# EAGLE design SensorHub_R2 (EAGLE 6.6.0)
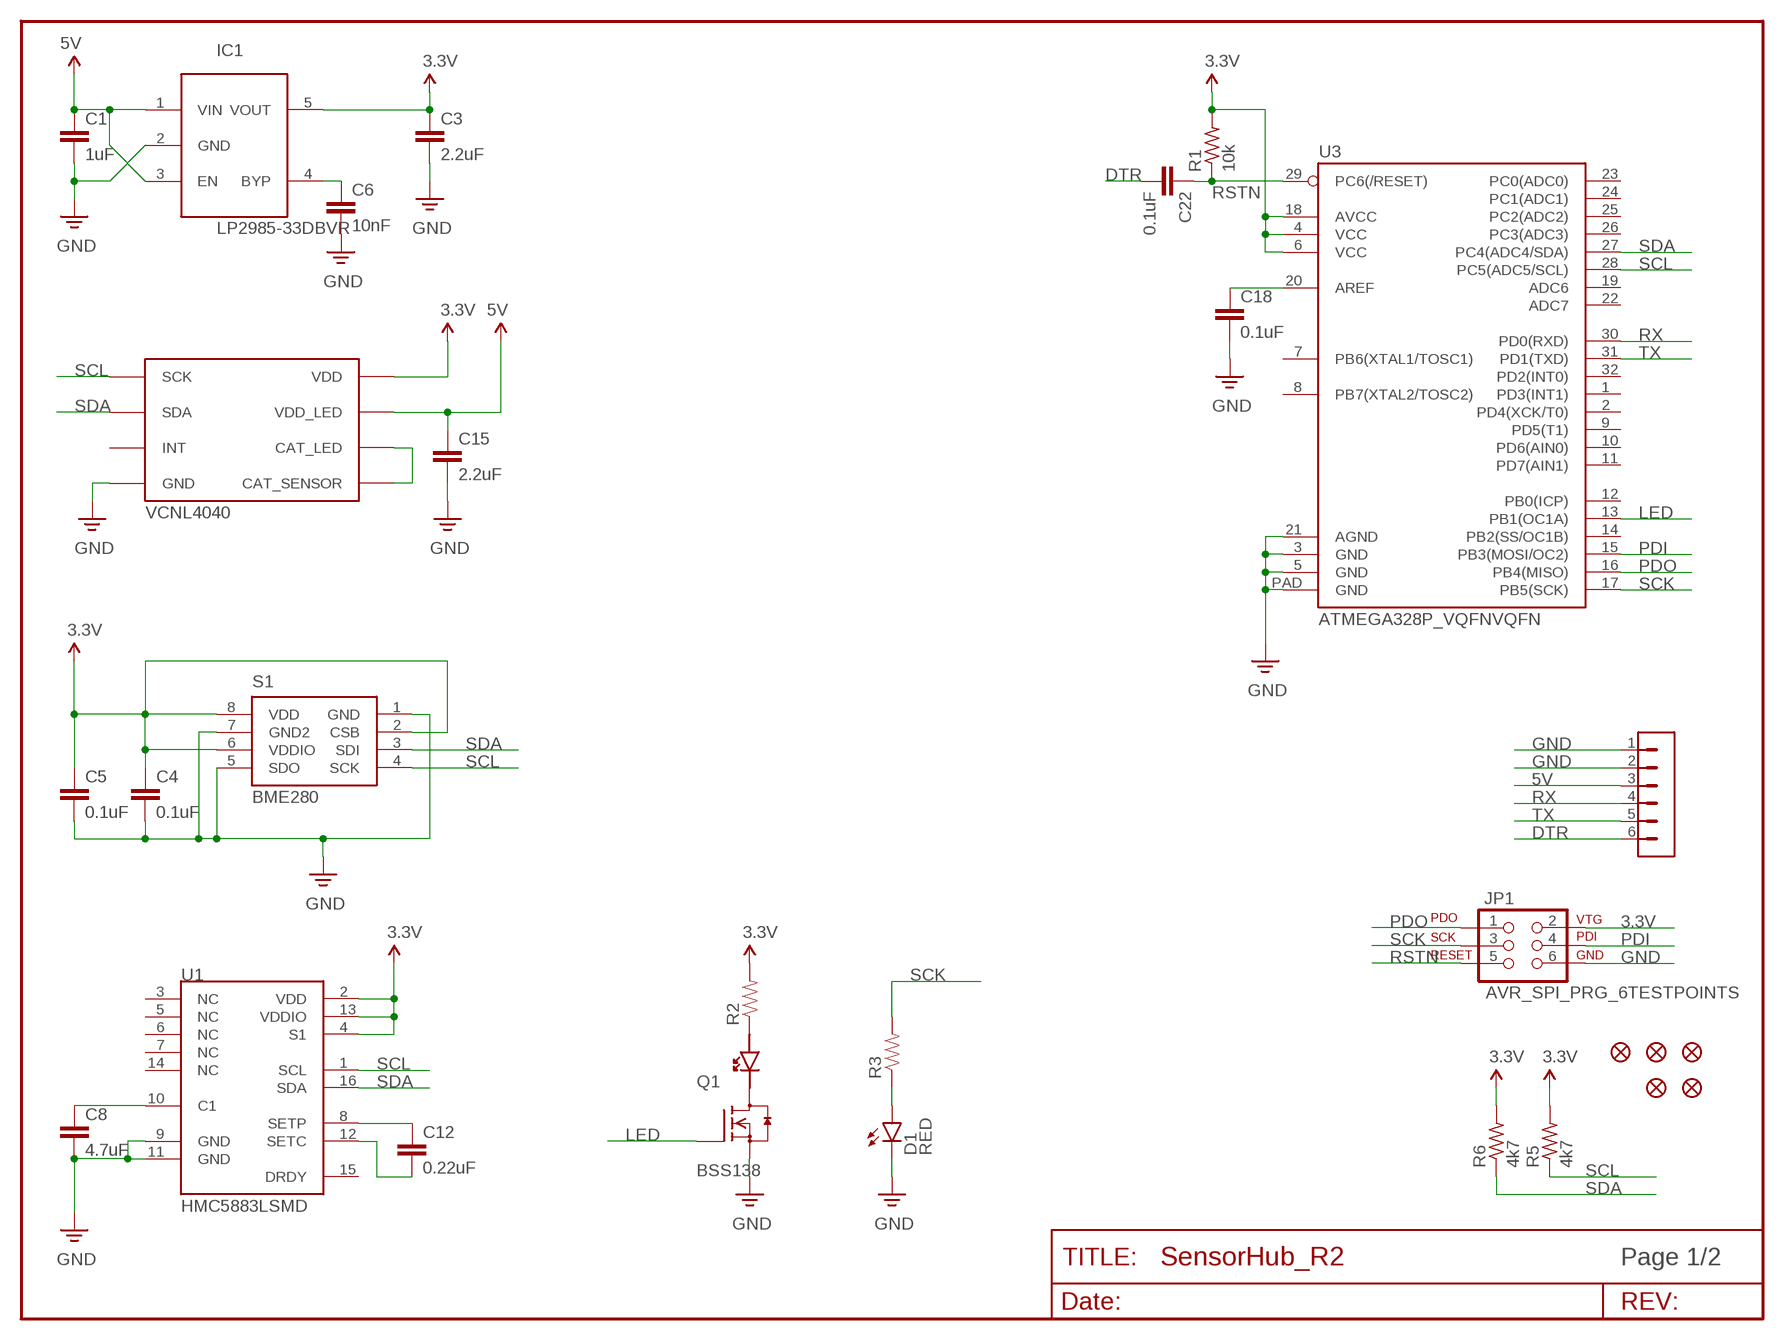
[diagram p0: schematic, sheet 1]

## Parts
C1  1uF  CAP0603-CAP  [0603-CAP]
C3  2.2uF  CAP0603-CAP  [0603-CAP]
C4  0.1uF  CAP0603-CAP  [0603-CAP]
C5  0.1uF  CAP0603-CAP  [0603-CAP]
C6  10nF  CAP0603-CAP  [0603-CAP]
C8  4.7uF  CAP0603-CAP  [0603-CAP]
C12  0.22uF  CAP0603-CAP  [0603-CAP]
C15  2.2uF  CAP0603-CAP  [0603-CAP]
C18  0.1uF  CAP0603-CAP  [0603-CAP]
C22  0.1uF  CAP0603-CAP  [0603-CAP]
D1  RED  LED-RED0603  [LED-0603]
FID1  FIDUCIALUFIDUCIAL  [MICRO-FIDUCIAL]
FID2  FIDUCIALUFIDUCIAL  [MICRO-FIDUCIAL]
FID3  FIDUCIALUFIDUCIAL  [MICRO-FIDUCIAL]
FID4  FIDUCIALUFIDUCIAL  [MICRO-FIDUCIAL]
FID5  FIDUCIALUFIDUCIAL  [MICRO-FIDUCIAL]
IC1  LP2985-33DBVR  LP298XS  [SOT23-5L]
JP1  AVR_SPI_PRG_6TESTPOINTS  [2X3_TEST_POINTS]
Q1  BSS138  [SOT23]
R1  10k  R-US_R0603  [R0603]
R2  RESISTOR0603  [0603-RES]
R3  RESISTOR0603  [0603-RES]
R5  4k7  R-US_R0603  [R0603]
R6  4k7  R-US_R0603  [R0603]
S1  BME280  [BME280]
U1  HMC5883LSMD  [16LPCC]
U3  ATMEGA328P_VQFNVQFN  ATMEGA328P_MLFMLF32  [MLF32-PAD]
U$1  M06-LONG  [M06-LONG]
U$3  VCNL4040  [VCNL4040]
U$4  PLCC_LED  [LED-PLCC]

## Nets
3.3V: C3.1 C4.1 C5.1 IC1.5(VOUT) JP1.2 R1.2 R2.2 R5.2 R6.2 S1.2(CSB) S1.6(VDDIO) S1.8(VDD) U1.2(VDD) U1.4(S1) U1.13(VDDIO) U3.4(VCC) U3.6(VCC) U3.18(AVCC) U$3.3(VDD)
5V: C1.1 C15.1 IC1.1(VIN) IC1.3(EN) U$1.3 U$3.4(VDD_LED)
DTR: C22.2 U$1.6
GND: C1.2 C3.2 C4.2 C5.2 C6.2 C8.2 C15.2 C18.2 D1.C IC1.2(GND) JP1.6 Q1.2(S) S1.1(GND) S1.5(SDO) S1.7(GND2) U1.9(GND) U1.11(GND) U3.3(GND) U3.5(GND) U3.21(AGND) U3.PAD(GND) U$1.1 U$1.2 U$3.1(GND)
LED: Q1.1(G) U3.13(PB1(OC1A))
N$2: Q1.3(D) U$4.CATHODE
N$3: R2.1 U$4.ANODE
N$4: D1.A R3.1
N$6: C6.1 IC1.4(BYP)
N$9: U$3.2(CAT_SENSOR) U$3.5(CAT_LED)
N$12: C18.1 U3.20(AREF)
N$14: C8.1 U1.10(C1)
N$15: C12.1 U1.8(SETP)
N$16: C12.2 U1.12(SETC)
PDI: JP1.4 U3.15(PB3(MOSI/OC2))
PDO: JP1.1 U3.16(PB4(MISO))
RSTN: C22.1 JP1.5 R1.1 U3.29(PC6(/RESET))
RX: U3.30(PD0(RXD)) U$1.4
SCK: JP1.3 R3.2 U3.17(PB5(SCK))
SCL: R5.1 S1.4(SCK) U1.1(SCL) U3.28(PC5(ADC5/SCL)) U$3.8(SCK)
SDA: R6.1 S1.3(SDI) U1.16(SDA) U3.27(PC4(ADC4/SDA)) U$3.7(SDA)
TX: U3.31(PD1(TXD)) U$1.5
Unconnected: U1.3(NC) U1.5(NC) U1.6(NC) U1.7(NC) U1.14(NC) U1.15(DRDY) U3.1(PD3(INT1)) U3.2(PD4(XCK/T0)) U3.7(PB6(XTAL1/TOSC1)) U3.8(PB7(XTAL2/TOSC2)) U3.9(PD5(T1)) U3.10(PD6(AIN0)) U3.11(PD7(AIN1)) U3.12(PB0(ICP)) U3.14(PB2(SS/OC1B)) U3.19(ADC6) U3.22(ADC7) U3.23(PC0(ADC0)) U3.24(PC1(ADC1)) U3.25(PC2(ADC2)) U3.26(PC3(ADC3)) U3.32(PD2(INT0)) U$3.6(INT)

## Notes on the sheet
- Page 1/2

## Library data of the parts
C1 C3-C6 C8 C12 C15 C18 C22 = SparkFun-Capacitors:CAP: Capacitor Standard 0603 ceramic capacitor, and 0.1" leaded capacitor.
D1 = SparkFun-LED:LED-RED: Assorted Red LEDs LilyPad 1206- DIO-09912 1206- DIO-00809 0603- DIO-00819 "SMART" means more efficient and expensive; PROD_ID: DIO-00819
FID1-FID5 = SparkFun-Aesthetics:FIDUCIAL: Fiducial Alignment Points Various fiducial points for machine vision alignment.
IC1 = adafruit:LP298X
JP1 = SparkFun-Connectors:AVR_SPI_PRG_6: AVR ISP 6 Pin This is the reduced ISP connector for AVR programming. Common on Arduino. This footprint will take up less PCB space and can be used with a 10-pin to 6-pin adapter such as SKU: BOB-08508 **Special note about "TEST_POINT" package. The stop mask is on the top side, so if you want your programming test points to be on the bottom of your board, make sure to place this package on the bottom side of the board. This also ensure that the orientation to program from the bottom side will be correct.
Q1 = m-pad-2.1:BSS138: Fairchild Semiconductors BSS138 N-Channel Logic Level Enhancement Mode Field Effect Transistor General Description: These N-Channel enhancement mode field effect transistors are produced using Fairchild's proprietary, high cell density, DMOS technology. These products have been designed to minimize on-state resistance while provide rugged, reliable, and fast switching performance.These products are particularly suited for low voltage, low current applications such as small servo motor control, power MOSFET gate drivers, and other switching applications. Features: 0.22 A, 50 V. RDS(ON) = 3.5Ohm @ VGS = 10 V RDS(ON) = 6.0Ohm @ VGS = 4.5 V High density cell design for extremely low RDS(ON) Rugged and Reliable Compact industry standard SOT-23 surface mount package Please send any comments to: messi@users.sourceforge.net
R1 R5 R6 = adafruit:R-US_: RESISTOR, American symbol
R2 R3 = SparkFun-Resistors:RESISTOR: Resistor Basic schematic elements and footprints for 0603, 1206, and PTH resistors.
S1 = L1:BME280
U1 = SparkFun-Sensors:HMC5883L: 3 Axis Digital Compass IC; PROD_ID: IC-10284
U3 = SparkFun-DigitalIC:ATMEGA328P_MLF: 32-Pin Atmega328 part Commonly used on Arduino compatible boards Available in QFP and QFN packages TQFP is IC-09069 QFN is non-stock
U$1 = pinhead-half:M06-LONG
U$3 = L1:VCNL4040
U$4 = L1:PLCC_LED

## Net classes
1 Tline: width 0.003 mm, drill 0.33 mm
2 120v Mains 5A: clearance 1.27 mm

## Board
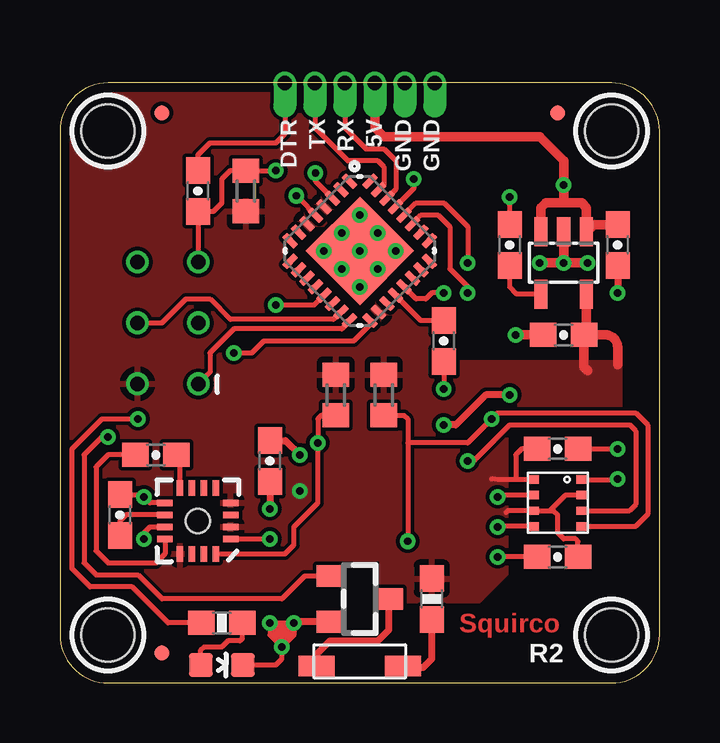
[diagram p1: board, top side]
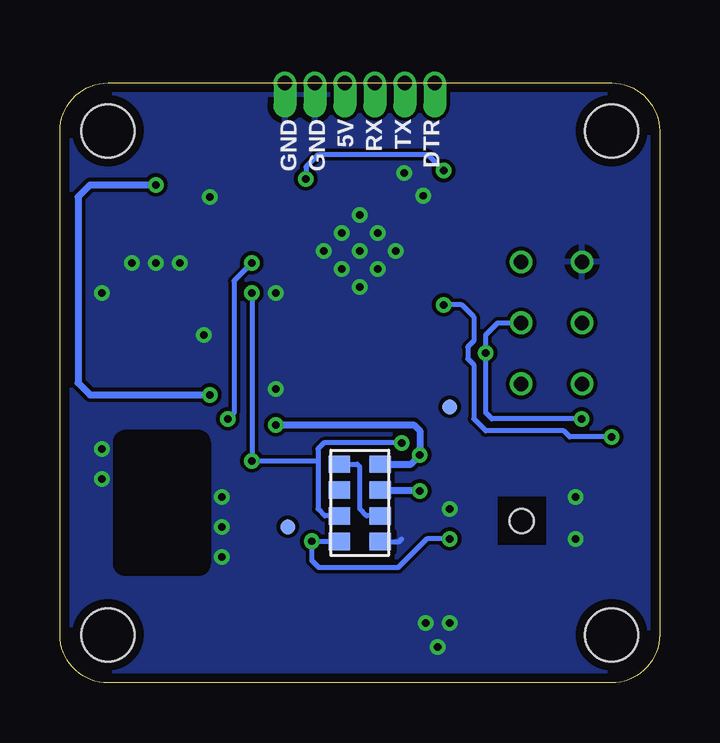
[diagram p2: board, bottom side, seen from below]

Size 25 x 25 mm. Coordinates in mm from the lower left corner, seen from the top.
Outline: 0,23 0,2 arc90 2,0 23,0 arc90 25,2 25,23 arc90 23,25 2,25 arc90 0,23
Copper layers (1*16): Top 0.0356mm / dielectric 1.5011mm / Bottom 0.0356mm
Design rules "LaenPCBOrder": minimum track width 6mil, minimum drill 0.3mm, track to track 6mil, track to pad 6mil, pad to pad 6mil, via to via 6mil, smd to smd 6mil, copper to edge 15mil, drill to drill 6mil, minimum pad ring 7mil, minimum via ring 7mil, stop-mask expansion 3mil, vias tented up to drill 15mil, thermal gap 10mil
Holes 2.2 mm at 23,2 2,2 2,23 23,23
Holes 1 mm at 5.75,6.75

### Footprints (pad centres in the part's own frame; a part is rotated, then mirrored left to right if it is on the bottom)
0603-CAP = smd 1.1 x 1: 1 -0.85,0; 2 0.85,0
LED-0603 = smd 1 x 1: A 0,-0.877; C 0,0.877
MICRO-FIDUCIAL = smd 0.635 x 0.635: 1 0,0
SOT23-5L = smd 0.55 x 1.2: 1 -0.95,-1.3; 2 0,-1.3; 3 0.95,-1.3; 4 0.95,1.3; 5 -0.95,1.3
2X3_TEST_POINTS = drill 0.6: 1 -2.54,-1.27; 2 -2.54,1.27; 3 0,-1.27; 4 0,1.27; 5 2.54,-1.27; 6 2.54,1.27
SOT23 = smd 0.9 x 1.2: 1 -0.95,-1.2; 2 0.95,-1.2; 3 0,1.2
R0603 = smd 1 x 1.1: 1 -0.85,0; 2 0.85,0
0603-RES = smd 1.1 x 1: 1 -0.85,0; 2 0.85,0
BME280 = smd 0.5 x 0.35: 1 1.025,0.975; 2 1.025,0.325; 3 1.025,-0.325; 4 1.025,-0.975; 5 -1.025,-0.975; 6 -1.025,-0.325; 7 -1.025,0.325; 8 -1.025,0.975
16LPCC = smd 0.65 x 0.28: 1 -1.37,0.75; 2 -1.37,0.25; 3 -1.37,-0.25; 4 -1.37,-0.75; 9 1.37,-0.75; 10 1.37,-0.25; 11 1.37,0.25; 12 1.37,0.75 | smd 0.28 x 0.65: 5 -0.75,-1.37; 6 -0.25,-1.37; 7 0.25,-1.37; 8 0.75,-1.37; 13 0.75,1.37; 14 0.25,1.37; 15 -0.25,1.37; 16 -0.75,1.37
MLF32-PAD = smd 0.7 x 0.3: 1 -2.35,1.75; 2 -2.35,1.25; 3 -2.35,0.75; 4 -2.35,0.25; 5 -2.35,-0.25; 6 -2.35,-0.75; 7 -2.35,-1.25; 8 -2.35,-1.75; 17 2.35,-1.75; 18 2.35,-1.25; 19 2.35,-0.75; 20 2.35,-0.25; 21 2.35,0.25; 22 2.35,0.75; 23 2.35,1.25; 24 2.35,1.75 | smd 0.3 x 0.7: 9 -1.75,-2.35; 10 -1.25,-2.35; 11 -0.75,-2.35; 12 -0.25,-2.35; 13 0.25,-2.35; 14 0.75,-2.35; 15 1.25,-2.35; 16 1.75,-2.35; 25 1.75,2.35; 26 1.25,2.35; 27 0.75,2.35; 28 0.25,2.35; 29 -0.25,2.35; 30 -0.75,2.35; 31 -1.25,2.35; 32 -1.75,2.35 | smd 3.2 x 3.2: PAD 0,0
M06-LONG = drill 0.6 offset: 1 0,-3.125; 2 0,-1.875; 3 0,-0.625; 4 0,0.625; 5 0,1.875; 6 0,3.125
VCNL4040 = smd 0.9 x 0.725: 1 0.85,-1.613; 2 0.85,-0.537; 3 0.85,0.537; 4 0.85,1.613; 5 -0.85,1.613; 6 -0.85,0.537; 7 -0.85,-0.537; 8 -0.85,-1.613
LED-PLCC = smd 1.5 x 0.85: ANODE -1.8,0; CATHODE 1.8,0

### Placement (x,y rotation side)
C1  23.25,18.25 270 top
C3  21,14.5 180 top
C4  20.75,9.75 0 top
C5  20.75,5.25 180 top
C6  18.75,18.25 90 top
C8  2.5,7 90 top
C12  4,9.5 180 top
C15  8.75,9.25 270 top
C18  16,14.25 270 top
C22  5.75,20.5 90 top
D1  6.75,0.75 270 top
FID1  20.75,23.75 0 top
FID2  15.5,6.5 0 bottom
FID3  4.25,1.25 0 top
FID4  4.25,23.75 0 top
FID5  8.75,11.5 0 bottom
IC1  21,17.5 180 top
JP1  4.5,15 90 top
Q1  12.5,3.5 270 top
R1  7.75,20.5 270 top
R2  15.5,3.5 90 top
R3  6.75,2.5 180 top
R5  13.5,12 90 top
R6  11.5,12 90 top
S1  20.75,7.5 0 top
U1  5.75,6.75 180 top
U3  12.5,18 315 top
U$1  12.5,25 90 top
U$3  12.5,7.5 0 bottom
U$4  12.5,0.7 180 top

### Tracks (layer width: path | path; a pad name or v marks a point on that pad's centre or on a via)
3.3V  (via drill 0.3)
  Top 0.2: S1.8 19,8.47 | 19,8.47 18.27,8.47 18,8.5 | C4.1 19.25,9.75 19,9.5 19,8.47 | 20.43,7.17 S1.6 18.68,7.17 18.6,7.1 | 20.43,7.17 21.07,7.83 S1.2 | C5.1 21.6,5.9 21.5,6 21,6 20.75,6.25 20.75,7 20.57,7.17 20.43,7.17
  Top 0.4: IC1.5 21.95,14.6 C3.1 21.85,13.15 22,13 | 22,14.5 22.75,14.5 arc-90 23.25,14 23.25,13.25
  Bottom 0.3: U$3.3 10.04,8.04 v10,8
  pour Top: -0.5,25 26.25,25 26,-0.75 -0.75,-0.75
5V  (via drill 0.3)
  Top 0.3: v18.75,12 17.75,12 16.5,10.75 v16,10.75 | C15.1 9.4,10.1 v10,9.5
  Top 0.4: IC1.3 20.05,19.8 20.25,20 21,20 | C1.1 22.25,19.1 IC1.1 21.95,19.8 21.75,20 21,20 | 21,20 v21,20.75 21,21.75 20,22.75 13.5,22.75 13.12,23.12 U$1.3
  Bottom 0.3: U$3.4 10.36,9.11 v10,9.5 10,10.5 10.25,10.75 v16,10.75 | v18.75,12 23.75,12 24.25,12.5 24.25,20.25 23.75,20.75 v21,20.75
DTR
  Top 0.2: C22.2 5.75,22 6.25,22.5 9,22.5 9.38,22.88 U$1.6
GND  (via drill 0.3)
  Top 0.2: 10.35,19.8 U3.5 10,20.15 v9.85,20.3 | 11.05,20.5 11.36,20.19 U3.3 10.65,20.91 v10.65,21.25 | C6.2 v18.75,20.25 | U1.9 3.75,7.5 v3.5,7.75 3.4,7.85 C8.2 | v3.5,6 3.5,6.25 3.75,6.5 U1.11 | S1.7 18.32,7.83 v18.25,7.75 | S1.5 18.27,6.53 v18.25,6.5 | C4.2 v23.25,9.75 | S1.1 22.98,8.47 v23.25,8.5 | C5.2 v18.25,5.25 | U3.21 14.85,16 15.25,16 15.5,16.25 v16,16.25 | C18.2 v16,12.25 | D1.C 9,0.75 9.25,1 v9.25,1.5 | 9.25,2 v8.75,2.5 | v8.75,2.5 9,2.5 | 9,2.5 v9.75,2.5 | v9.75,2.5 9.75,2.25 | 9.75,2.25 9.75,2 v9.25,1.5 | v8.75,2.5 8.75,2.25 | 8.75,2.25 8.75,2 v9.25,1.5 | v9.25,1.5 9.25,1.75 | 9.25,1.75 9.25,2 | 9.25,2 v9.75,2.5 | v9.75,2.5 9.5,2.5 9.25,2.25 9,2.5 | 8.75,2.25 9.25,1.75 | 9.25,1.75 9.75,2.25
  Top 0.3: C15.2 v8.75,7.25 | Q1.2 9.8,2.55 v9.75,2.5 | C1.2 v23.25,16.25
  Top 0.4: v21,17.5 IC1.2 | v22,17.5 v20,17.5 | v19,14.5 C3.2
  Bottom 0.2: U$3.1 10.86,5.89 10.75,6
  other vias: 12.5,18 13.25,18.75 12.5,16.5 11,18 14,18 11.75,18.75 12.5,19.5 13.25,17.25 11.75,17.25
  pour Bottom: -1.5,25 27,25 27,-2 -1.5,-2
LED  (via drill 0.3)
  Top 0.2: v2,10.25 1.75,10.25 1,9.5 1,5 1.5,4.5 3.25,4.5 4.25,3.5 9.25,3.5 10.2,4.45 Q1.1 | v9,15.75 10.6,15.75 U3.13
  Bottom 0.2: v9,15.75 8.25,15.75 7.75,15.25 7.75,14.25 8,14 8,13.5 7.75,13.25 7.75,11 7.25,10.5 4,10.5 3.75,10.25 v2,10.25
N$1
  cutout Top: 4.85,7.65 6.65,7.65 6.65,5.85 4.85,5.85
  cutout Bottom: 4.75,7.75 6.75,7.75 6.75,5.75 4.75,5.75
N$2
  Top 0.3: U$4.CATHODE 10.7,1.2 11.25,1.75 13.25,1.75 13.7,2.2 Q1.3
N$3
  Top 0.3: U$4.ANODE 14.5,0.65 15.15,0.65 15.5,1 R2.1
N$4
  Top 0.2: R3.1 7.6,1.85 7.5,1.75 7,1.75 6.75,1.5 6,1.5 5.87,1.37 D1.A
N$5
  cutout Top: 15.5,25.25 15.5,13.5 23.5,13.5 23.5,11.25 25.25,11.25 25.25,25.25
N$6
  Top 0.2: IC1.4 19.05,16.2 18.75,16.5 C6.1
N$7
  cutout Top: 19.45,16.65 19.45,18.35 22.5,18.35 22.5,16.65
N$8
  cutout Bottom: 11.1,9.9 13.9,9.9 13.9,5.1 11.1,5.1
N$9
  Bottom 0.2: U$3.5 12.61,9.11 12.5,9 12.5,7.25 12.21,6.96 U$3.2
N$10
  cutout Top: 22.25,4.5 18.75,4.5 18.75,10 arc-90 19.25,10.5 22.25,10.5 arc-90 22.75,10 22.75,5 arc-90
N$11
  cutout Top: 0.25,0.25 0.25,3.25 11.75,3.25 11.75,5 13.25,5 13.25,3.25 17.5,3.25 18.75,4.5 24.75,4.5 24.75,0.25
N$12
  Top 0.2: C18.1 15.05,15.1 U3.20
N$13
  cutout Bottom: 22.25,4.5 19.25,4.5 arc-90 18.75,5 18.75,10 arc-90 19.25,10.5 22.25,10.5 arc-90 22.75,10 22.75,5 arc-90
N$14
  Top 0.2: U1.10 2.75,7 2.5,6.75 C8.1
N$15
  Top 0.2: U1.8 5,9.1 C12.1
N$16
  Top 0.2: C12.2 2,9.5 1.5,9 1.5,5.5 2,5 4,5 4.38,5.38 U1.12
N$17
  cutout Top: 5.25,20.75 8.25,20.75 8.25,20.25 5.25,20.25
PDI
  Top 0.2: U3.15 11.7,15.45 11.4,15.15 7.1,15.15 6.25,16 5.25,16 4.25,15 JP1.4
PDO
  Top 0.2: U3.16 12.08,15.08 11.75,14.75 7.25,14.75 6.25,13.75 6.25,12.94 JP1.1
RSTN  (via drill 0.3)
  Top 0.2: v9,21.35 R1.1 7.1,21.35 6.75,21 6.75,20 6.4,19.65 C22.1 5.75,17.56 JP1.5 | v14.75,21 14.75,20.6 U3.29 13.98,19.89
  Bottom 0.2: v14.75,21 14.75,21.5 14.25,22 9.65,22 v9,21.35
RX
  Top 0.2: U3.30 14,20.56 14,21.75 13.5,22.25 12.75,22.25 11.88,23.12 U$1.4
SCK  (via drill 0.3)
  Top 0.2: U3.17 12.92,14.92 12.25,14.25 8.5,14.25 8,13.75 v7.25,13.75 | R3.2 4.5,2.5 3,4 1.25,4 0.5,4.75 0.5,9.75 1.75,11 v3.25,11
  Bottom 0.2: v3.25,11 7,11 7.25,11.25 v7.25,13.75 7.25,14.5 6.75,15 JP1.3
SCL  (via drill 0.3)
  Top 0.2: U1.1 v8.75,6 | S1.4 24,6.53 24.5,7.03 24.5,10.75 24,11.25 18.25,11.25 v18,11 17,10 14.5,10 | U3.28 14.85,20 16,20 17,19 v17,17.5 | 14.5,10 v14.5,5.9 | R5.1 14.35,11.15 14.5,11 14.5,10
  Bottom 0.2: v8.75,6 9.7,6 10.9,4.8 14.2,4.8 14.5,5.1 v14.5,5.9 14.49,5.89 U$3.8 | v17,17.5 17.75,16.75 17.75,11.25 v18,11
SDA  (via drill 0.3)
  Top 0.2: S1.3 23.75,7.17 24,7.42 24,10.5 23.75,10.75 18.75,10.75 17.25,9.25 v17,9.25 | U3.27 15.06,19.5 15.75,19.5 16.25,19 16.25,17.25 17,16.5 v17,16.25 | U1.16 9.38,5.38 9.75,5.75 9.75,6.5 10.75,7.5 v10.75,10 10.75,11 10.9,11.15 R6.1
  Bottom 0.2: v17,16.25 v17,9.25 14.25,9.25 | v10.75,10 14,10 14.25,9.75 14.25,9.25 | 14.25,9.25 14.25,7.25 13.96,6.96 U$3.7
TX
  Top 0.2: U3.31 13.3,20.55 13.5,20.75 13.5,21.5 13.25,21.75 12,21.75 10.62,23.12 U$1.5

### Text on the board
Top: Squirco
tPlace: DTR / TX / RX / 5V / GND / GND | R2
bPlace: GND / GND / 5V / RX / TX / DTR
tStop: Squirco